# EAGLE design teamNACHOrev2 (EAGLE 7.4.0)
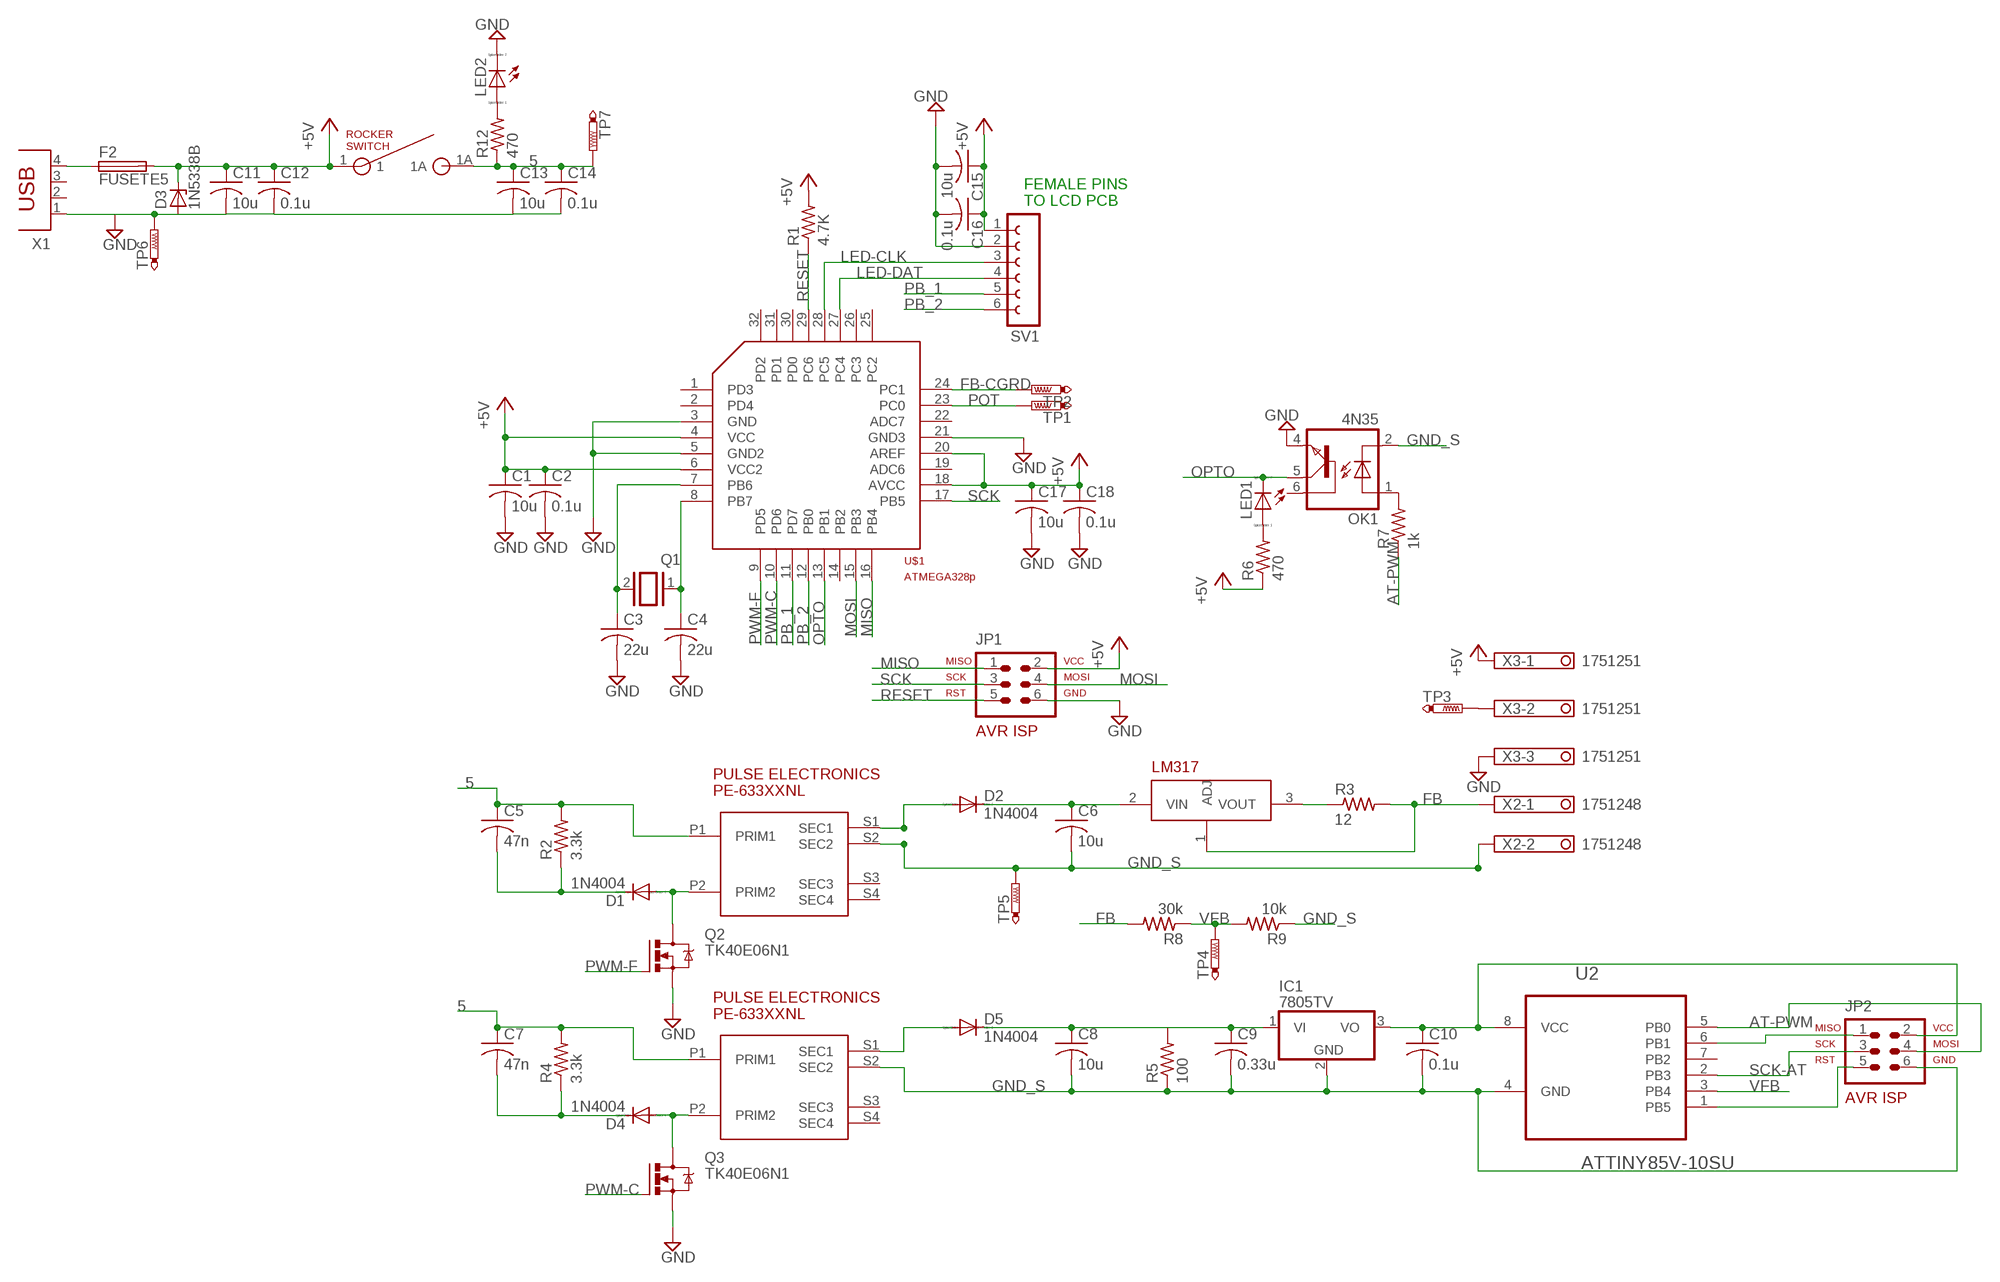
[diagram p0: schematic, sheet 1]

## Parts
C1  10u  C-USC0805  [C0805]
C2  0.1u  C-USC0805  [C0805]
C3  22u  C-USC0805  [C0805]
C4  22u  C-USC0805  [C0805]
C5  47n  C-USC0805  [C0805]
C6  10u  C-USC0805  [C0805]
C7  47n  C-USC0805  [C0805]
C8  10u  C-USC0805  [C0805]
C9  0.33u  C-USC0805  [C0805]
C10  0.1u  C-USC0805  [C0805]
C11  10u  C-USC0805  [C0805]
C12  0.1u  C-USC0805  [C0805]
C13  10u  C-USC0805  [C0805]
C14  0.1u  C-USC0805  [C0805]
C15  10u  C-USC0805  [C0805]
C16  0.1u  C-USC0805  [C0805]
C17  10u  C-USC0805  [C0805]
C18  0.1u  C-USC0805  [C0805]
D1  1N4004  [DO41-10]
D2  1N4004  [DO41-10]
D3  1N5338B  1N5333  [C1702-15]
D4  1N4004  [DO41-10]
D5  1N4004  [DO41-10]
F2  FUSETE5  [TE5]
IC1  7805TV  [TO220V]
JP1  AVR-ISP-6VERT  [AVR-ISP-6]
JP2  AVR-ISP-6VERT  [AVR-ISP-6]
LED1  LED_ELD260  [LED_LD260]
LED2  LED_ELD260  [LED_LD260]
OK1  4N35  [DIL06]
Q1  XTAL/S  [QS]
Q2  TK40E06N1  IRF520  [TO220BV]
Q3  TK40E06N1  IRF520  [TO220BV]
R1  4.7K  R-US_R0805  [R0805]
R2  3.3k  R-US_R0805  [R0805]
R3  12  R-US_M0805  [M0805]
R4  3.3k  R-US_R0805  [R0805]
R5  100  R-US_R0805  [R0805]
R6  470  R-US_M0805  [M0805]
R7  1k  R-US_M0805  [M0805]
R8  30k  R-US_R0805  [R0805]
R9  10k  R-US_R0805  [R0805]
R12  470  R-US_M0805  [M0805]
SV1  FE06-1  [FE06]
TP1  PTR1PAD1-20  [P1-20]
TP2  PTR1PAD1-20  [P1-20]
TP3  PTR1PAD1-20  [P1-20]
TP4  PTR1PAD1-20  [P1-20]
TP5  PTR1PAD1-20  [P1-20]
TP6  PTR1PAD1-20  [P1-20]
TP7  PTR1PAD1-20  [P1-20]
U2  ATTINY85V-10SU  [SOIC127P798X216-8N]
U$1  ATMEGA328P  [TQFP32]
U$2  PE-63388NL  [PE-633XXNL]
U$3  LM317  [TO220V]
U$4  COM-08837  [ROCKERSWITCH]
U$5  PE-63388NL  [PE-633XXNL]
X1  PN87520  [PN87520]
X2  1751248  [1751248]
X3  1751251  [1751251]

## Nets
5: C5.1 C7.1 C13.1 C14.1 R2.2 R4.2 R12.1 TP7.TP U$2.P1(PRIM1) U$4.1A U$5.P1(PRIM1)
+5V: C1.1 C2.1 C11.1 C12.1 C15.1 C16.1 C17.1 C18.1 D3.C F2.2 JP1.2 R1.2 R6.1 SV1.1 U$1.4(VCC) U$1.6(VCC2) U$1.18(AVCC) U$1.20(AREF) U$4.1 X3.1
AT-PWM: JP2.4 R7.1 U2.5(PB0)
FB: R3.2 R8.2 U$3.1(ADJ) X2.1
FB-CGRD: TP2.TP U$1.24(PC1)
GND: C1.2 C2.2 C3.2 C4.2 C11.2 C12.2 C13.2 C14.2 C15.2 C16.2 C17.2 C18.2 D3.A JP1.6 LED2.K(C) OK1.4(EMI) Q2.S Q3.S SV1.2 TP6.TP U$1.3(GND) U$1.5(GND2) U$1.21(GND3) X1.1 X3.3
GND_S: C6.2 C8.2 C9.2 C10.2 IC1.2(GND) JP2.6 OK1.2(C) R5.1 R9.1 TP5.TP U2.4(GND) U$2.S2(SEC2) U$5.S2(SEC2) X2.2
LED-CLK: SV1.3 U$1.28(PC5)
LED-DAT: SV1.4 U$1.27(PC4)
MISO: JP1.1 U$1.16(PB4)
MOSI: JP1.4 U$1.15(PB3)
N$1: C5.2 D1.C R2.1
N$2: C3.1 Q1.2 U$1.7(PB6)
N$3: C4.1 Q1.1 U$1.8(PB7)
N$4: D1.A Q2.D U$2.P2(PRIM2)
N$5: C8.1 C9.1 D5.C IC1.1(VI) R5.2
N$6: D2.A U$2.S1(SEC1)
N$7: C6.1 D2.C U$3.2(VIN)
N$8: R3.1 U$3.3(VOUT)
N$9: LED2.A R12.2
N$10: LED1.A R6.2
N$11: TP3.TP X3.2
N$14: D4.A Q3.D U$5.P2(PRIM2)
N$15: C7.2 D4.C R4.1
N$17: D5.A U$5.S1(SEC1)
N$18: C10.1 IC1.3(VO) JP2.2 U2.8(VCC)
N$20: OK1.1(A) R7.2
N$22: JP2.5 U2.1(PB5)
N$23: JP2.1 U2.6(PB1)
N$29: F2.1 X1.4
OPTO: LED1.K(C) OK1.5(COL) U$1.13(PB1)
PB_1: SV1.5 U$1.11(PD7)
PB_2: SV1.6 U$1.12(PB0)
POT: TP1.TP U$1.23(PC0)
PWM-C: Q3.G U$1.10(PD6)
PWM-F: Q2.G U$1.9(PD5)
RESET: JP1.5 R1.1 U$1.29(PC6)
SCK: JP1.3 U$1.17(PB5)
SCK-AT: JP2.3 U2.2(PB3)
VFB: R8.1 R9.2 TP4.TP U2.3(PB4)
Unconnected: OK1.6(BAS) U2.7(PB2) U$1.1(PD3) U$1.2(PD4) U$1.14(PB2) U$1.19(ADC6) U$1.22(ADC7) U$1.25(PC2) U$1.26(PC3) U$1.30(PD0) U$1.31(PD1) U$1.32(PD2) U$2.S3(SEC3) U$2.S4(SEC4) U$5.S3(SEC3) U$5.S4(SEC4) X1.2 X1.3

## Notes on the sheet
- FEMALE PINS
  TO LCD PCB

## Library data of the parts
C1-C18 = rcl:C-US: CAPACITOR, American symbol
D1 D2 D4 D5 = diode:1N4004: DIODE general purpose rectifier, 1 A
D3 = diode:1N5333: Z DIODE 3.3 V, 5W, 5 percent (Motorola)
F2 = fuse:FUSE: Fuse; OC_FARNELL: unknown; OC_NEWARK: unknown
IC1 = linear:78*: Positive VOLTAGE REGULATOR Source: http://cache.national.com/ds/LM/LM78L05.pdf http://www.fairchildsemi.com/ds/LM/LM7805.pdf
JP1 JP2 = avr-7:AVR-ISP-6: AVR ISP-6 Serial Programming Header
LED1 LED2 = eagle-ltspice:LED_E: LED Source: http://www.osram.convergy.de Source: www.luxeon.com Source: www.kingbright.com; SPICEMODEL: NONE; SPICEPREFIX: D; SPICETYPE: diode
OK1 = optocoupler:4N35: MOTOROLA OPTO COUPLER; MF: FAIRCHILD SEMICONDUCTOR; MPN: 4N35; OC_FARNELL: 1328375; OC_NEWARK: 72K9946
Q1 = special:XTAL/S: CRYSTAL
Q2 Q3 = transistor-power:IRF520: HEXFET Power MOSFET
R1 R3 R6 R7 R12 = rcl:R-US_: RESISTOR, American symbol
R2 R4 R5 R8 R9 = resistor:R-US_: RESISTOR, American symbol
SV1 = con-lsta:FE06-1: FEMALE HEADER; OC_FARNELL: unknown; OC_NEWARK: unknown
TP1-TP7 = testpad:PTR1: TEST PIN
U2 = Atmel_By_element14_Batch_1-00:ATTINY85V-10SU: 8-bit Microcontroller with In-System Programmable Flash; MPN: ATTINY85V-10SU; OC_FARNELL: 1455166; OC_NEWARK: 58M3799; PACKAGE: SOIC-8; SUPPLIER: Atmel
U$1 = ATMEGA328p:ATMEGA328P
U$2 U$5 = PE-63388NL:PE-63388NL
U$3 = LM317:LM317
U$4 = ROCKSW:COM-08837
X1 = con-berg:PN87520: BERG USB connector; OC_FARNELL: unknown; OC_NEWARK: unknown
X2 = con-phoenix-350:1751248: MKDS 1/ 2-3,5 Printklemme Nennstrom: 10 A Bemessungsspannung: 160 V Raster: 3,5 mm Polzahl: 2 Montageart: Löten Anschlussart: Schraubanschluss Anschlussrichtung vom Leiter zur Platine: 0° Source: http://eshop.phoenixcontact.com .. 1751248.pdf; OC_FARNELL: unknown; OC_NEWARK: unknown
X3 = con-phoenix-350:1751251: MKDS 1/ 3-3,5 Printklemme Nennstrom: 10 A Bemessungsspannung: 160 V Raster: 3,5 mm Polzahl: 3 Montageart: Löten Anschlussart: Schraubanschluss Anschlussrichtung vom Leiter zur Platine: 0° Source: http://eshop.phoenixcontact.com .. 1751251.pdf; OC_FARNELL: unknown; OC_NEWARK: unknown

## Board
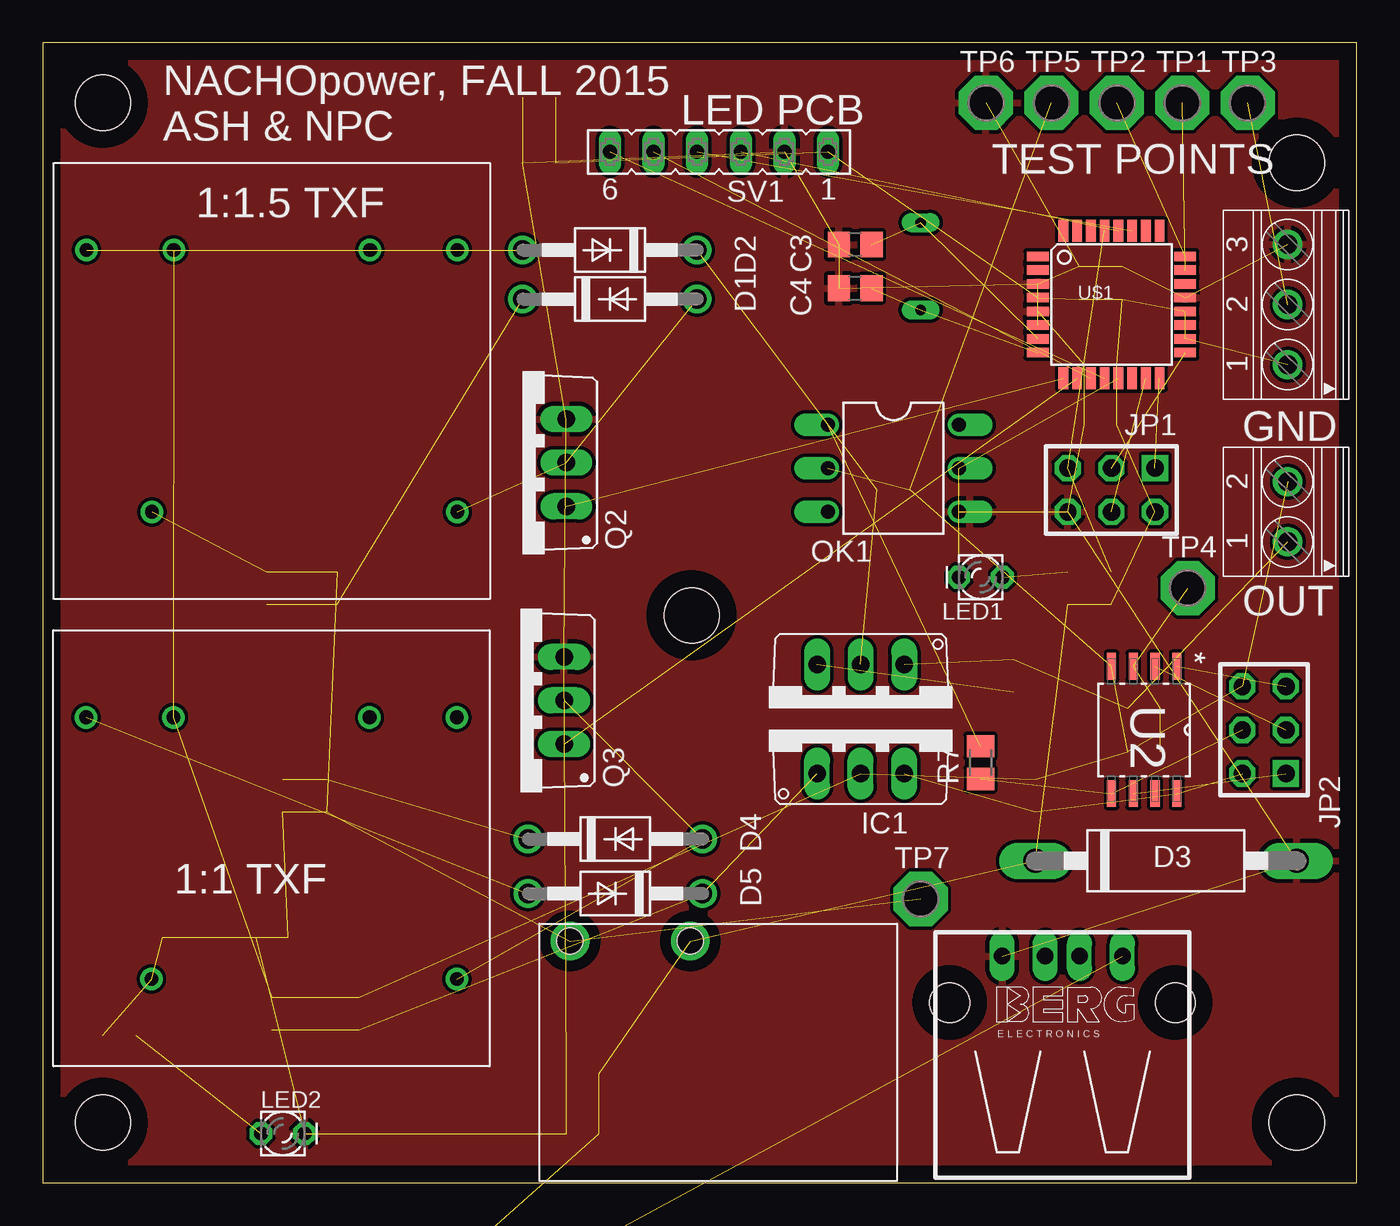
[diagram p1: board, top side]
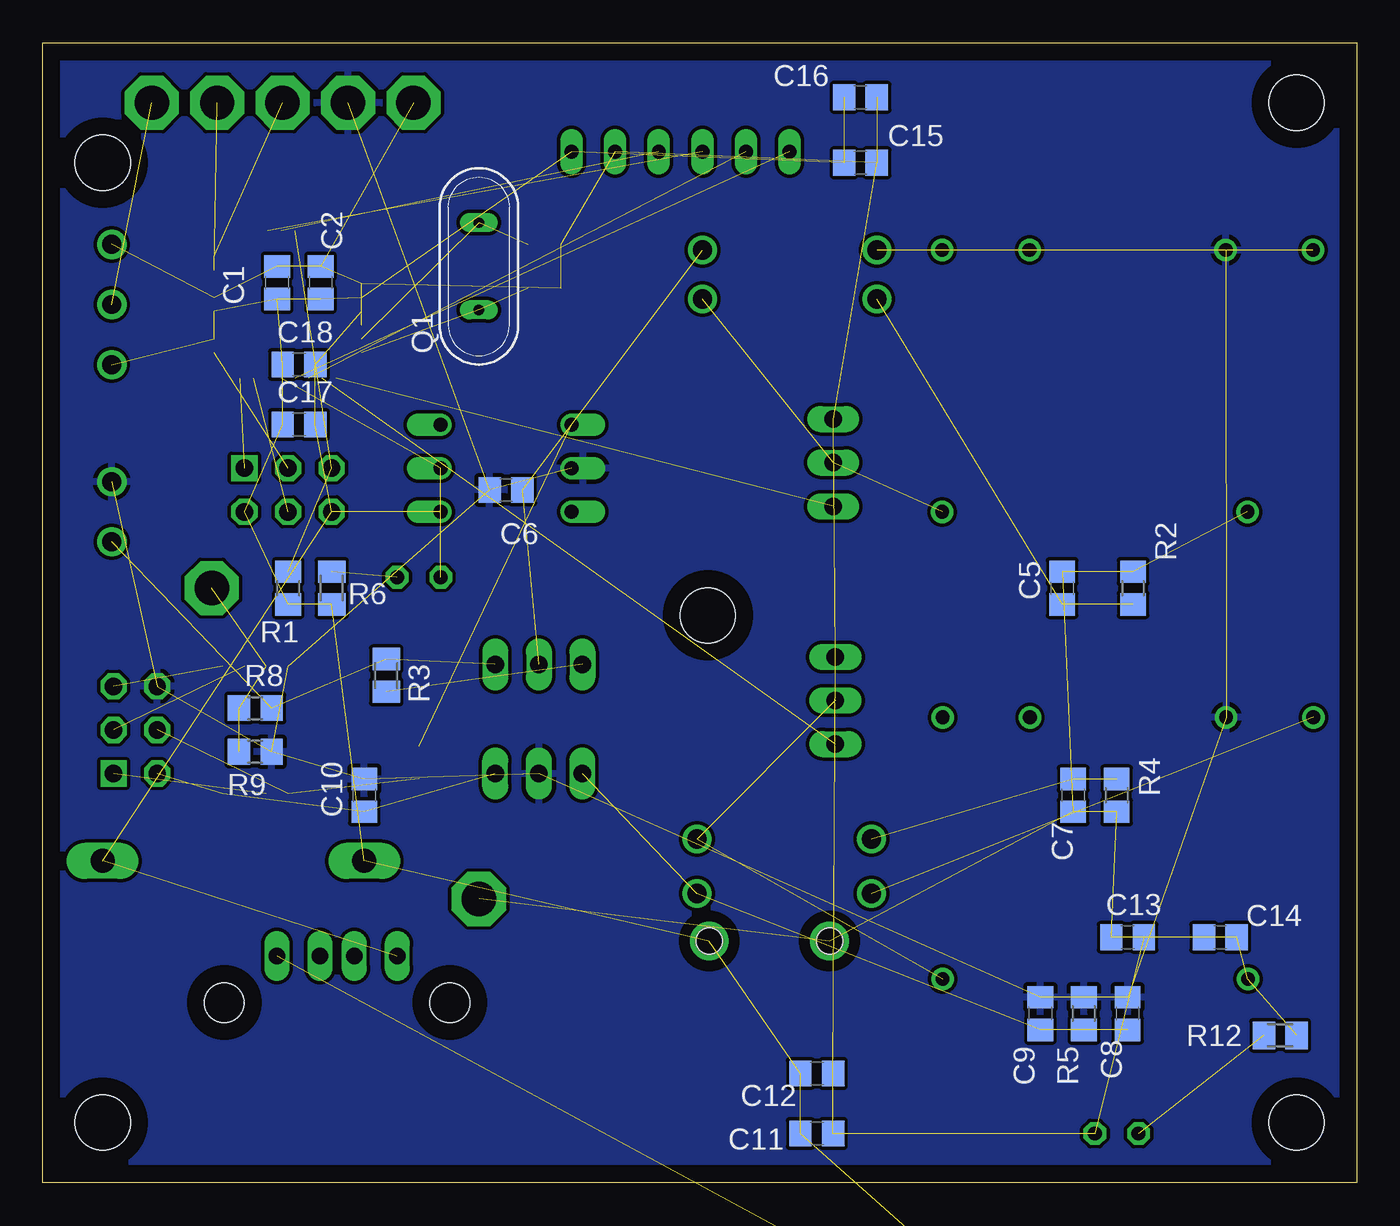
[diagram p2: board, bottom side, seen from below]

Size 76.5 x 66.35 mm. Coordinates in mm from the lower left corner, seen from the top.
Outline: 0,0 76.5,0 76.5,66.35 0,66.35 0,0
Copper layers (1*16): Top 0.035mm / dielectric 1.5mm / Bottom 0.035mm
Design rules "default": minimum track width 10mil, minimum drill 24mil, track to track 8mil, track to pad 8mil, pad to pad 8mil, via to via 8mil, smd to smd 8mil, copper to edge 40mil, drill to drill 8mil, minimum pad ring 10mil, minimum via ring 8mil, stop-mask expansion 4mil, vias tented up to drill 0mil, thermal gap 10mil
Holes 3.2 mm at 73.03,59.37 73.03,3.49 3.49,3.49 3.49,62.87 37.78,33.02

### Footprints (pad centres in the part's own frame; a part is rotated, then mirrored left to right if it is on the bottom)
C0805 = smd 1.3 x 1.5: 1 -0.95,0; 2 0.95,0
DO41-10 = drill 1.118: A 5.08,0; C -5.08,0
C1702-15 = drill 1.397 long: A 7.62,0; C -7.62,0
TE5 = drill 1.016 long: 1 -2.54,0; 2 2.54,0
TO220V = drill 1.016 long: 1 -2.54,-2.54; 2 0,-2.54; 3 2.54,-2.54
AVR-ISP-6 = drill 1.016 square: 1 -2.54,-1.27 | drill 1.016 octagon: 2 -2.54,1.27; 3 0,-1.27; 4 0,1.27; 5 2.54,-1.27; 6 2.54,1.27
LED_LD260 = drill 0.813 octagon: A -1.27,0; K 1.27,0
DIL06 = drill 0.813 offset: 1 -2.54,-3.81; 2 0,-3.81; 3 2.54,-3.81; 4 2.54,3.81; 5 0,3.81; 6 -2.54,3.81
QS = drill 0.61 long: 1 -2.54,0; 2 2.54,0
TO220BV = drill 1.016 long: D 0,-2.54; G -2.54,-2.54; S 2.54,-2.54
R0805 = smd 1.3 x 1.5: 1 -0.95,0; 2 0.95,0
M0805 = smd 1.3 x 1.6: 1 -0.95,0; 2 0.95,0
FE06 = drill 0.813 long: 1 -6.35,0; 2 -3.81,0; 3 -1.27,0; 4 1.27,0; 5 3.81,0; 6 6.35,0
P1-20 = drill 2.007 pad 3.15 octagon: TP 0,0
SOIC127P798X216-8N = smd 1.549 x 0.533: 1 -3.708,1.905; 2 -3.708,0.635; 3 -3.708,-0.635; 4 -3.708,-1.905; 5 3.708,-1.905; 6 3.708,-0.635; 7 3.708,0.635; 8 3.708,1.905
TQFP32 = smd 1.27 x 0.559: 1 -4.293,2.8; 2 -4.293,2; 3 -4.293,1.2; 4 -4.293,0.4; 5 -4.293,-0.4; 6 -4.293,-1.2; 7 -4.293,-2; 8 -4.293,-2.8; 17 4.293,-2.8; 18 4.293,-2; 19 4.293,-1.2; 20 4.293,-0.4; 21 4.293,0.4; 22 4.293,1.2; 23 4.293,2; 24 4.293,2.8 | smd 0.559 x 1.27: 9 -2.8,-4.293; 10 -2,-4.293; 11 -1.2,-4.293; 12 -0.4,-4.293; 13 0.4,-4.293; 14 1.2,-4.293; 15 2,-4.293; 16 2.8,-4.293; 25 2.8,4.293; 26 2,4.293; 27 1.2,4.293; 28 0.4,4.293; 29 -0.4,4.293; 30 -1.2,4.293; 31 -2,4.293; 32 -2.8,4.293
PE-633XXNL = drill 0.8: P1 0,0; P2 0,-17.78; S1 15.24,3.81; S2 15.24,-1.27; S3 15.24,-12.7; S4 15.24,-17.78
ROCKERSWITCH = drill 1.5: 1 12.04,-13.97; 1A 19.05,-13.97 | hole 1.499: 19.05,-13.97; 12.04,-13.97
PN87520 = drill 0.95 long: 1 -3.5,2.71; 2 -1,2.71; 3 1,2.71; 4 3.5,2.71 | hole 2.3: -6.57,0; 6.57,0
1751248 = drill 1.1 pad 1.7: 1 -1.75,-0.1; 2 1.75,-0.1
1751251 = drill 1.1 pad 1.7: 1 -3.5,-0.1; 2 0,-0.1; 3 3.5,-0.1

### Placement (x,y rotation side)
C1  62.87,52.39 90 bottom
C2  60.33,52.39 90 bottom
C3  47.31,54.61 180 top
C4  47.31,52.07 180 top
C5  17.14,34.61 270 bottom
C6  49.53,40.32 180 bottom
C7  16.51,22.54 90 bottom
C8  13.34,9.84 90 bottom
C9  18.41,9.84 90 bottom
C10  57.78,22.54 90 bottom
C11  31.43,2.86 0 bottom
C12  31.43,6.35 0 bottom
C13  13.34,14.29 0 bottom
C14  7.94,14.29 180 bottom
C15  28.89,59.37 0 bottom
C16  28.89,63.18 0 bottom
C17  61.59,44.13 0 bottom
C18  61.59,47.62 0 bottom
D1  33.02,51.44 0 top
D2  33.02,54.29 180 top
D3  65.41,18.73 0 top
D4  33.34,20 0 top
D5  33.34,16.83 180 top
F2  4.13,-20 0 top  (outside the outline)
IC1  47.62,26.35 0 top
JP1  62.23,40.32 180 top
JP2  71.12,26.35 90 top
LED1  54.61,35.24 180 top
LED2  13.97,2.86 0 top
OK1  49.53,41.59 270 top
Q1  51.12,53.34 90 bottom
Q2  27.94,41.91 90 top
Q3  27.81,28.07 90 top
R1  62.23,34.61 270 bottom
R2  13.02,34.61 90 bottom
R3  56.52,29.53 90 bottom
R4  13.97,22.54 270 bottom
R5  15.88,9.84 270 bottom
R6  59.69,34.61 90 bottom
R7  54.61,24.45 90 top
R8  64.14,27.62 0 bottom
R9  64.14,25.08 180 bottom
R12  4.45,8.57 180 bottom
SV1  39.37,60.01 180 top
TP1  66.36,62.87 0 top
TP2  62.55,62.87 0 top
TP3  70.17,62.87 0 top
TP4  66.67,34.61 0 top
TP5  58.74,62.87 0 top
TP6  54.93,62.87 0 top
TP7  51.12,16.51 0 top
U2  64.14,26.35 270 top
U$1  62.23,51.12 0 top
U$2  6.35,39.05 90 top
U$3  47.62,27.62 180 top
U$4  49.75,0.09 180 top
U$5  6.32,11.85 90 top
X1  59.37,10.48 0 top
X2  72.39,39.05 90 top
X3  72.39,51.12 90 top

### Tracks (layer width: path | path; a pad name or v marks a point on that pad's centre or on a via)
5  (10 unrouted)
+5V  (19 unrouted)
AT-PWM  (2 unrouted)
FB  (3 unrouted)
FB-CGRD  (1 unrouted)
GND  (24 unrouted)
  pour Top: -0.64,67.63 77.15,67.94 77.47,-15.56 0,-15.56
GND_S  (13 unrouted)
  pour Bottom: -0.64,67.63 77.15,67.94 77.47,-15.56 0,-15.56
LED-CLK  (1 unrouted)
LED-DAT  (1 unrouted)
MISO  (1 unrouted)
MOSI  (1 unrouted)
N$1  (2 unrouted)
N$2  (2 unrouted)
N$3  (2 unrouted)
N$4  (2 unrouted)
N$5  (4 unrouted)
N$6  (1 unrouted)
N$7  (2 unrouted)
N$8  (1 unrouted)
N$9  (1 unrouted)
N$10  (1 unrouted)
N$11  (1 unrouted)
N$14  (2 unrouted)
N$15  (2 unrouted)
N$17  (1 unrouted)
N$18  (3 unrouted)
N$20  (1 unrouted)
N$22  (1 unrouted)
N$23  (1 unrouted)
N$29  (1 unrouted)
OPTO  (2 unrouted)
PB_1  (1 unrouted)
PB_2  (1 unrouted)
POT  (1 unrouted)
PWM-C  (1 unrouted)
PWM-F  (1 unrouted)
RESET  (2 unrouted)
SCK  (1 unrouted)
SCK-AT  (1 unrouted)
VFB  (3 unrouted)

### Text on the board
tPlace: LED PCB | NACHOpower, FALL 2015 / ASH & NPC | TEST POINTS | 1:1.5 TXF | GND | OUT | 1:1 TXF